# Altium schematic sheet МПСУ.464342.21-005Э3 Лист1.SchDoc
size 209 x 297 mm; Address1: Address1; Address2: Address2; Address3: Address3; Address4: Address4; SheetNumber: 2; SheetTotal: 5; Scale: 1:1; Разраб.: Лазба; Обозначение документа: МПСУ.464342.21-005 Э3; Пров.: Приходько; Общее количество листов: 5; Наименование организации: МИЭТ; Наименование изделия 1: Плата; Наименование изделия 2: Схема электрическая; Наименование изделия 3: принципиальная; Нач. отд.: Замдир; Фамилия нач. отд.: Лялин
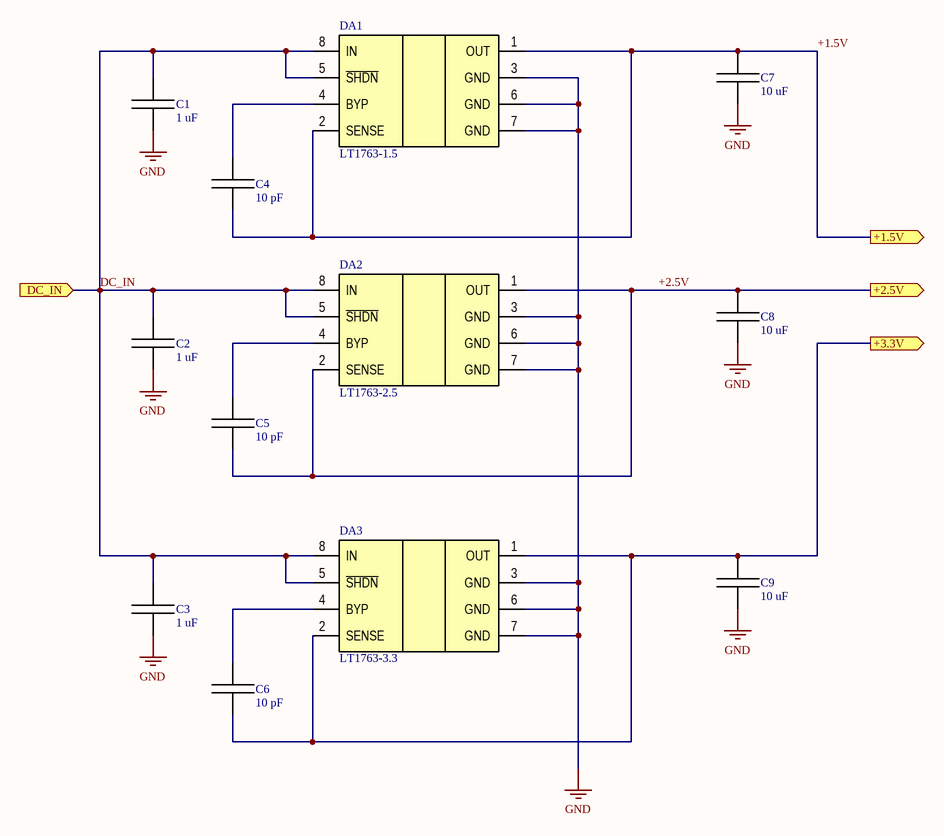
[diagram p0: МПСУ.464342.21-005Э3 Лист1.SchDoc]

## Parts
C1  1 uF  [CAPC160X80X90L30N]
C2  1 uF  [CAPC160X80X90L30N]
C3  1 uF  [CAPC160X80X90L30N]
C4  10 pF  [CAPC160X80X90L30N]
C5  10 pF  [CAPC160X80X90L30N]
C6  10 pF  [CAPC160X80X90L30N]
C7  10 uF  [CAPC160X80X90L30N]
C8  10 uF  [CAPC160X80X90L30N]
C9  10 uF  [CAPC160X80X90L30N]
DA1  LT1763-1.5  [SOIC8P127_490X600X175L83X41N]
DA2  LT1763-2.5  [SOIC8P127_490X600X175L83X41N]
DA3  LT1763-3.3  [SOIC8P127_490X600X175L83X41N]

## Ports
+1.5V (out), +2.5V (out), +3.3V (out), DC_IN (in)

## Nets
GND: C1.1 C2.1 C3.1 C7.1 C8.1 C9.1 DA1.3(GND) DA1.6(GND) DA1.7(GND) DA2.3(GND) DA2.6(GND) DA2.7(GND) DA3.3(GND) DA3.6(GND) DA3.7(GND)
+1.5V: C4.1 C7.2 DA1.1(OUT) DA1.2(SENSE) ; port +1.5V
+2.5V: C5.1 C8.2 DA2.1(OUT) DA2.2(SENSE) ; port +2.5V
+3.3V: C6.1 C9.2 DA3.1(OUT) DA3.2(SENSE) ; port +3.3V
DC_IN: C1.2 C2.2 C3.2 DA1.5(~{SHDN}) DA1.8(IN) DA2.5(~{SHDN}) DA2.8(IN) DA3.5(~{SHDN}) DA3.8(IN) ; port DC_IN
NetC4_2: C4.2 DA1.4(BYP)
NetC5_2: C5.2 DA2.4(BYP)
NetC6_2: C6.2 DA3.4(BYP)

## Notes on the sheet
- Перв. примен.
- Справ. №
- Подп. и дата
- Инв. № дубл.
- Взам. инв. №
- Разраб.
- Изм.
- Лист
- № докум.
- Подп.
- Дата
- Лит.
- Масса
- Масштаб
- Пров.
- Т.контр.
- Листов
- Инв. № подл.
- Утв.
- Н.контр.
- Копировал
- Формат А4

## Library data of the parts
C1-C9 = Capacitor: Capacitor, generic; PartNumber: X7R; Tolerance: ± 10 %; VDC: 16 V; Dielectric: *; Manufacturer: *; Package: 0603
  C1-C3: Value: 1 uF
  C4-C6: Value: 10 pF
  C7-C9: Value: 10 uF
DA1-DA3 = LT1763: Micropower DC/DC Converters in SOIC8; Manufacturer: Analog Devices